# Altium schematic sheet Reles.SchDoc
size A4
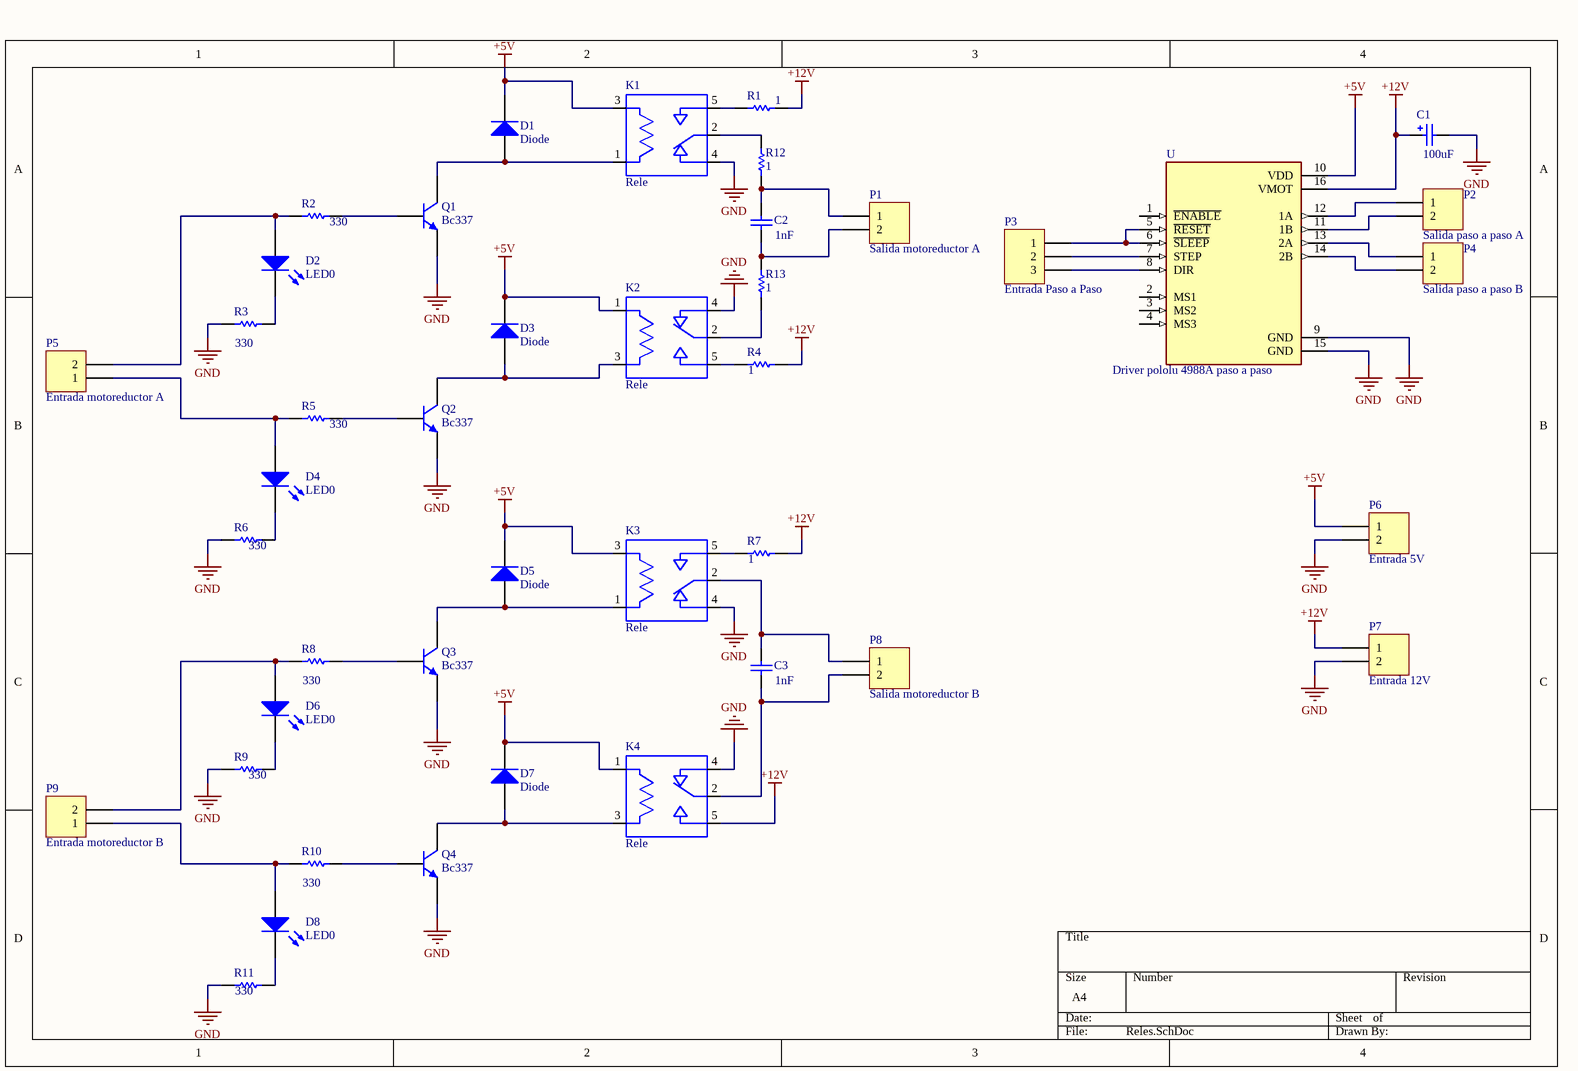
[diagram p0: Reles.SchDoc]

## Parts
C1  value 100uF  [RAD-0.1]  (hidden comment: Cap Pol2)
C2  value 1nF  [RAD-0.1]  (hidden comment: Cap)
C3  value 1nF  [RAD-0.1]  (hidden comment: Cap)
D1  Diode  [DIODE-0.4]
D2  LED0  [BAT-2]
D3  Diode  [DIODE-0.4]
D4  LED0  [BAT-2]
D5  Diode  [DIODE-0.4]
D6  LED0  [BAT-2]
D7  Diode  [DIODE-0.4]
D8  LED0  [BAT-2]
K1  Comment_1: Rele  [RELAY_1-1721150-0]  (hidden comment: 1-1721150-0)
K2  Comment_1: Rele  [RELAY_1-1721150-0]  (hidden comment: 1-1721150-0)
K3  Comment_1: Rele  [RELAY_1-1721150-0]  (hidden comment: 1-1721150-0)
K4  Comment_1: Rele  [RELAY_1-1721150-0]  (hidden comment: 1-1721150-0)
P1  Salida motoreductor A  [TE_282841-2]
P2  Salida paso a paso A  [TE_282841-2]
P3  Entrada Paso a Paso  [TE_1776275-3]
P4  Salida paso a paso B  [TE_282841-2]
P5  Entrada motoreductor A  [TE_282841-2]
P6  Entrada 5V  [TE_282841-2]
P7  Entrada 12V  [TE_282841-2]
P8  Salida motoreductor B  [TE_282841-2]
P9  Entrada motoreductor B  [TE_282841-2]
Q1  Bc337  [TO92254P520H877-3]
Q2  Bc337  [TO92254P520H877-3]
Q3  Bc337  [TO92254P520H877-3]
Q4  Bc337  [TO92254P520H877-3]
R1  value 1  [AXIAL-0.3]  (hidden comment: Res1)
R2  value 330  [AXIAL-0.3]  (hidden comment: Res1)
R3  value 330  [AXIAL-0.3]  (hidden comment: Res1)
R4  value 1  [AXIAL-0.3]  (hidden comment: Res1)
R5  value 330  [AXIAL-0.3]  (hidden comment: Res1)
R6  value 330  [AXIAL-0.3]  (hidden comment: Res1)
R7  value 1  [AXIAL-0.3]  (hidden comment: Res1)
R8  value 330  [AXIAL-0.3]  (hidden comment: Res1)
R9  value 330  [AXIAL-0.3]  (hidden comment: Res1)
R10  value 330  [AXIAL-0.3]  (hidden comment: Res1)
R11  value 330  [AXIAL-0.3]  (hidden comment: Res1)
R12  value 1  [AXIAL-0.3]  (hidden comment: Res1)
R13  value 1  [AXIAL-0.3]  (hidden comment: Res1)
U  Driver pololu 4988A paso a paso  [MODULE_A4988_STEPPER_MOTOR_DRIVER_CARRIER]

## Nets
+5V: D1.2(K) D3.2(K) D5.2(K) D7.2(K) K1.3 K2.1 K3.3 K4.1 P6.1 U.10(VDD)
+12V: C1.1 K4.5 P7.1 R1.2 R4.2 R7.2 U.16(VMOT)
GND: C1.2 K1.4 K2.4 K3.4 K4.4 P6.2 P7.2 Q1.1(E) Q2.1(E) Q3.1(E) Q4.1(E) R3.1 R6.1 R9.1 R11.1 U.9(GND) U.15(GND)
NetC2_1: C2.1 P1.2 R13.2
NetC2_2: C2.2 P1.1 R12.2
NetC3_1: C3.1 K4.2 P8.2
NetC3_2: C3.2 K3.2 P8.1
NetD1_1: D1.1(A) K1.1 Q1.3(C)
NetD2_1: D2.1(A) P5.2 R2.1
NetD2_2: D2.2(K) R3.2
NetD3_1: D3.1(A) K2.3 Q2.3(C)
NetD4_1: D4.1(A) P5.1 R5.1
NetD4_2: D4.2(K) R6.2
NetD5_1: D5.1(A) K3.1 Q3.3(C)
NetD6_1: D6.1(A) P9.2 R8.1
NetD6_2: D6.2(K) R9.2
NetD7_1: D7.1(A) K4.3 Q4.3(C)
NetD8_1: D8.1(A) P9.1 R10.1
NetD8_2: D8.2(K) R11.2
NetK1_2: K1.2 R12.1
NetK1_5: K1.5 R1.1
NetK2_2: K2.2 R13.1
NetK2_5: K2.5 R4.1
NetK3_5: K3.5 R7.1
NetP2_1: P2.1 U.12(1A)
NetP2_2: P2.2 U.11(1B)
NetP3_1: P3.1 U.5(~{RESET}) U.6(~{SLEEP})
NetP3_2: P3.2 U.7(STEP)
NetP3_3: P3.3 U.8(DIR)
NetP4_1: P4.1 U.13(2A)
NetP4_2: P4.2 U.14(2B)
NetQ1_2: Q1.2(B) R2.2
NetQ2_2: Q2.2(B) R5.2
NetQ3_2: Q3.2(B) R8.2
NetQ4_2: Q4.2(B) R10.2

Not connected (* = marked no-connect by the designer): U 1(~{ENABLE}) 2(MS1) 3(MS2) 4(MS3)

## Library data of the parts
C1 = Cap Pol2: Polarized Capacitor (Axial); Published: 8-Jun-2000; LatestRevisionDate: 17-Jul-2002; LatestRevisionNote: Re-released for DXP Platform.; PackageReference: POLAR0.8; Publisher: Altium Limited; PackageDescription: Polarized Capacitor; 2 Leads
C2 C3 = Cap: Capacitor; Published: 8-Jun-2000; LatestRevisionDate: 17-Jul-2002; LatestRevisionNote: Re-released for DXP Platform.; PackageReference: RAD-0.3; Publisher: Altium Limited; PackageDescription: Radial Cap, Thru-Hole; 2 Leads; 0.3 in Pin Spacing
D1 D3 D5 D7 = Diode: Default Diode; Published: 8-Jun-2000; LatestRevisionDate: 17-Jul-2002; LatestRevisionNote: Re-released for DXP Platform.; PackageVersion: Sep-1996; PackageReference: SMC; Publisher: Altium Limited; PackageDescription: DO-214-AB/SMC; 2 C-Bend Leads; Body 7.9 x 5.9 mm, inc. leads (LxW); Code_JEDEC: DO-214-AB
D2 D4 D6 D8 = LED0: Typical INFRARED GaAs LED; Published: 8-Jun-2000; LatestRevisionDate: 08-Jul-2005; LatestRevisionNote: Mech Layer 1 removed.; PackageReference: LED-0; Publisher: Altium Limited; PackageDescription: LED; 2 Leads
K1-K4 = 1-1721150-0: General Purpose Relay SPDT (1 Form C) 5VDC Coil Through Hole; MF: TE Connectivity; Package: None; Value: *; MP: 1-1721150-0; Availability: Unavailable; SnapEDA_Link: https://www.snapeda.com/parts/1-1721150-0/TE%20Connectivity%20Potter%20&%20Brumfield%20Relays/view-part/735210/?ref=snap; EU_RoHS_Compliance: Compliant; Price: None
P1 P2 P4-P9 = MHDR1X2: Header, 2-Pin; LatestRevisionDate: 17-Jul-2002; LatestRevisionNote: Re-released for DXP Platform.; Publisher: Altium Limited
P3 = MHDR1X3: Header, 3-Pin; LatestRevisionDate: 17-Jul-2002; LatestRevisionNote: Re-released for DXP Platform.; Publisher: Altium Limited
Q1-Q4 = 2N3904: NPN General Purpose Amplifier; Published: 8-Jun-2000; LatestRevisionDate: 15-Jan-2003; LatestRevisionNote: PCB Footprint 'BCY-W3/D4.7' replaced; DatasheetVersion: 1997; PackageVersion: Sep-1998; PackageReference: TO-92A; Publisher: Altium Limited; PackageDescription: TO, Flat Index; 3 In-Line, Axial Leads; Body Dia. 4.5mm; Leads 0.51 x 0.48 mm (max); ComponentLink1Description: Manufacturer Link; ComponentLink1URL: http://www.fairchildsemi.com/; ComponentLink2Description: Datasheet; ComponentLink2URL: http://www.fairchildsemi.com/ds/2N%2F2N3904.pdf
R1-R13 = Res1: Resistor; Published: 8-Jun-2000; LatestRevisionDate: 17-Jul-2002; LatestRevisionNote: Re-released for DXP Platform.; PackageReference: AXIAL-0.3; Publisher: Altium Limited; PackageDescription: Axial Device, Thru-Hole; 2 Leads; 0.3 in Pin Spacing
U = A4988_STEPPER_MOTOR_DRIVER_CARRIER: Stepper Motor Driver; MP: A4988 STEPPER MOTOR DRIVER CARRIER; Availability: Unavailable; Price: None; Package: None; Value: *; SnapEDA_Link: https://www.snapeda.com/parts/A4988%20STEPPER%20MOTOR%20DRIVER%20CARRIER/Pololu/view-part/1499394/?ref=snap; MF: Pololu